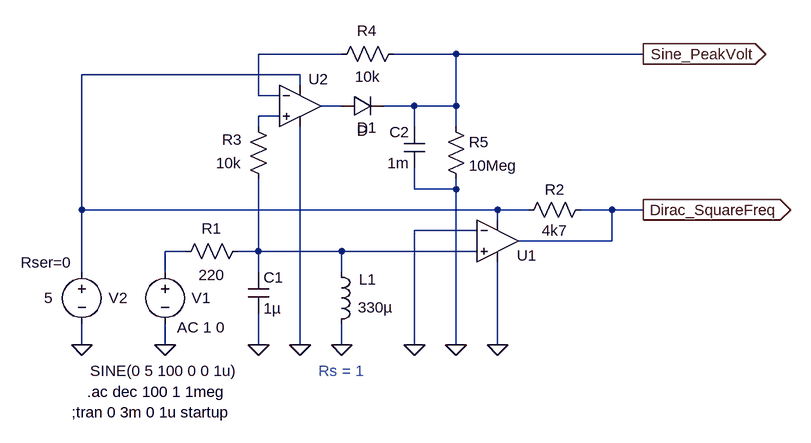
[diagram p0: schematic Inductometer.asc]
Inductometer.asc, the LTspice schematic file:
Version 4
SHEET 1 1052 680
WIRE 320 -208 192 -208
WIRE 496 -208 400 -208
WIRE 784 -208 496 -208
WIRE 256 -176 -80 -176
WIRE 256 -160 256 -176
WIRE 192 -144 192 -208
WIRE 224 -144 192 -144
WIRE 320 -128 288 -128
WIRE 432 -128 384 -128
WIRE 496 -128 496 -208
WIRE 496 -128 432 -128
WIRE 224 -112 192 -112
WIRE 192 -96 192 -112
WIRE 432 -96 432 -128
WIRE 496 -96 496 -128
WIRE 432 0 432 -32
WIRE 496 0 496 -16
WIRE 496 0 432 0
WIRE -80 32 -80 -176
WIRE 560 32 -80 32
WIRE 608 32 560 32
WIRE 736 32 688 32
WIRE 784 32 736 32
WIRE 560 48 560 32
WIRE 528 64 432 64
WIRE 736 80 736 32
WIRE 736 80 592 80
WIRE 80 96 48 96
WIRE 192 96 192 -16
WIRE 192 96 160 96
WIRE 320 96 192 96
WIRE 528 96 320 96
WIRE -80 128 -80 32
WIRE 48 128 48 96
WIRE 192 128 192 96
WIRE 320 128 320 96
WIRE -80 240 -80 208
WIRE 48 240 48 208
WIRE 192 240 192 192
WIRE 256 240 256 -96
WIRE 320 240 320 208
WIRE 432 240 432 64
WIRE 496 240 496 0
WIRE 560 240 560 112
FLAG 192 240 0
FLAG 320 240 0
FLAG 432 240 0
FLAG 48 240 0
FLAG 560 240 0
FLAG -80 240 0
FLAG 784 32 Dirac_SquareFreq
IOPIN 784 32 Out
FLAG 256 240 0
FLAG 496 240 0
FLAG 784 -208 Sine_PeakVolt
IOPIN 784 -208 Out
SYMBOL ind 304 112 R0
WINDOW 0 43 27 Left 2
WINDOW 3 41 70 Left 2
SYMATTR InstName L1
SYMATTR Value 330µ
SYMATTR SpiceLine Rser=1
SYMBOL cap 176 128 R0
SYMATTR InstName C1
SYMATTR Value 1µ
SYMBOL res 176 80 R90
WINDOW 0 -4 56 VBottom 2
WINDOW 3 37 56 VTop 2
SYMATTR InstName R1
SYMATTR Value 220
SYMBOL voltage 48 112 R0
WINDOW 0 41 56 Left 2
WINDOW 3 -115 168 Left 2
WINDOW 123 19 101 Left 2
WINDOW 39 0 0 Left 0
SYMATTR InstName V1
SYMATTR Value SINE(0 5 100 0 0 1u)
SYMATTR Value2 AC 1 0
SYMBOL voltage -80 112 R0
WINDOW 0 41 56 Left 2
WINDOW 3 -58 56 Left 2
WINDOW 123 0 0 Left 0
WINDOW 39 -94 1 Left 2
SYMATTR InstName V2
SYMATTR Value 5
SYMATTR SpiceLine Rser=0
SYMBOL res 704 16 R90
WINDOW 0 0 56 VBottom 2
WINDOW 3 32 56 VTop 2
SYMATTR InstName R2
SYMATTR Value 4k7
SYMBOL OpAmps\\UniversalOpAmp2 560 80 R0
WINDOW 0 30 22 Left 2
SYMATTR InstName U1
SYMBOL OpAmps\\UniversalOpAmp2 256 -128 R0
WINDOW 0 13 -41 Left 2
SYMATTR InstName U2
SYMBOL res 208 0 R180
WINDOW 0 41 76 Left 2
WINDOW 3 42 40 Left 2
SYMATTR InstName R3
SYMATTR Value 10k
SYMBOL res 416 -224 R90
WINDOW 0 -4 57 VBottom 2
WINDOW 3 35 56 VTop 2
SYMATTR InstName R4
SYMATTR Value 10k
SYMBOL diode 320 -112 R270
WINDOW 0 -33 39 VTop 2
WINDOW 3 -6 32 VBottom 2
SYMATTR InstName D1
SYMBOL cap 448 -32 R180
WINDOW 0 24 56 Left 2
WINDOW 3 24 8 Left 2
SYMATTR InstName C2
SYMATTR Value 1m
SYMBOL res 480 -112 R0
SYMATTR InstName R5
SYMATTR Value 10Meg
TEXT -96 344 Left 2 !;tran 0 3m 0 1u startup
TEXT -72 312 Left 2 !.ac dec 100 1 1meg
TEXT 320 280 Center 2 ;Rs = 1

The netlist it stands for:
* Inductometer.asc
L1 N006 0 330µ Rser=1
C1 N006 0 1µ
R1 N006 N005 220
V1 N005 0 SINE(0 5 100 0 0 1u) AC 1 0
V2 N002 0 5 Rser=0
R2 Dirac_SquareFreq N002 4k7
XU1 N006 0 N002 0 Dirac_SquareFreq level2 Avol=1Meg GBW=10Meg Slew=10Meg Ilimit=25m Rail=0 Vos=0 En=0 Enk=0 In=0 Ink=0 Rin=500Meg  ; pins In+ In- V+ V- OUT
XU2 N004 N001 N002 0 N003 level2 Avol=1Meg GBW=10Meg Slew=10Meg Ilimit=25m Rail=0 Vos=0 En=0 Enk=0 In=0 Ink=0 Rin=500Meg  ; pins In+ In- V+ V- OUT
R3 N006 N004 10k
R4 Sine_PeakVolt N001 10k
D1 N003 Sine_PeakVolt D
C2 0 Sine_PeakVolt 1m
R5 Sine_PeakVolt 0 10Meg
.model D D
.lib standard.dio
;tran 0 3m 0 1u startup
.ac dec 100 1 1meg
* Rs = 1
.lib UniversalOpAmp2.lib
.backanno
.end